# EAGLE schematic whiskashisei-ver4.1 (EAGLE 9.0.1)
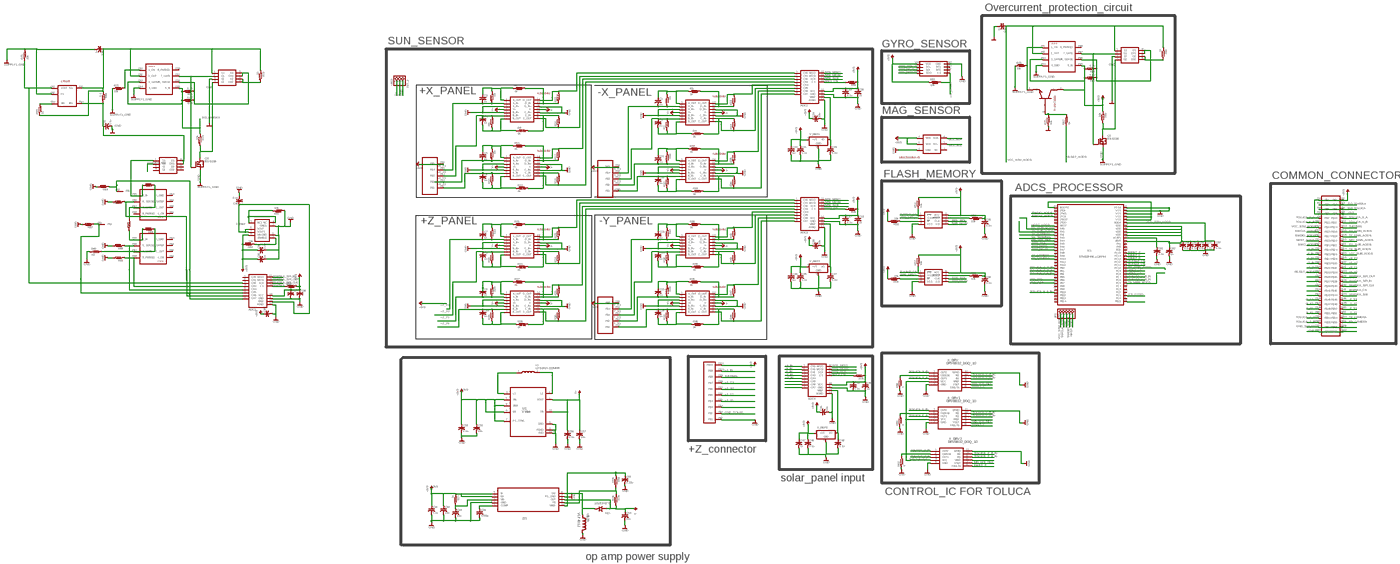
[diagram p0: schematic, sheet 1, overview]
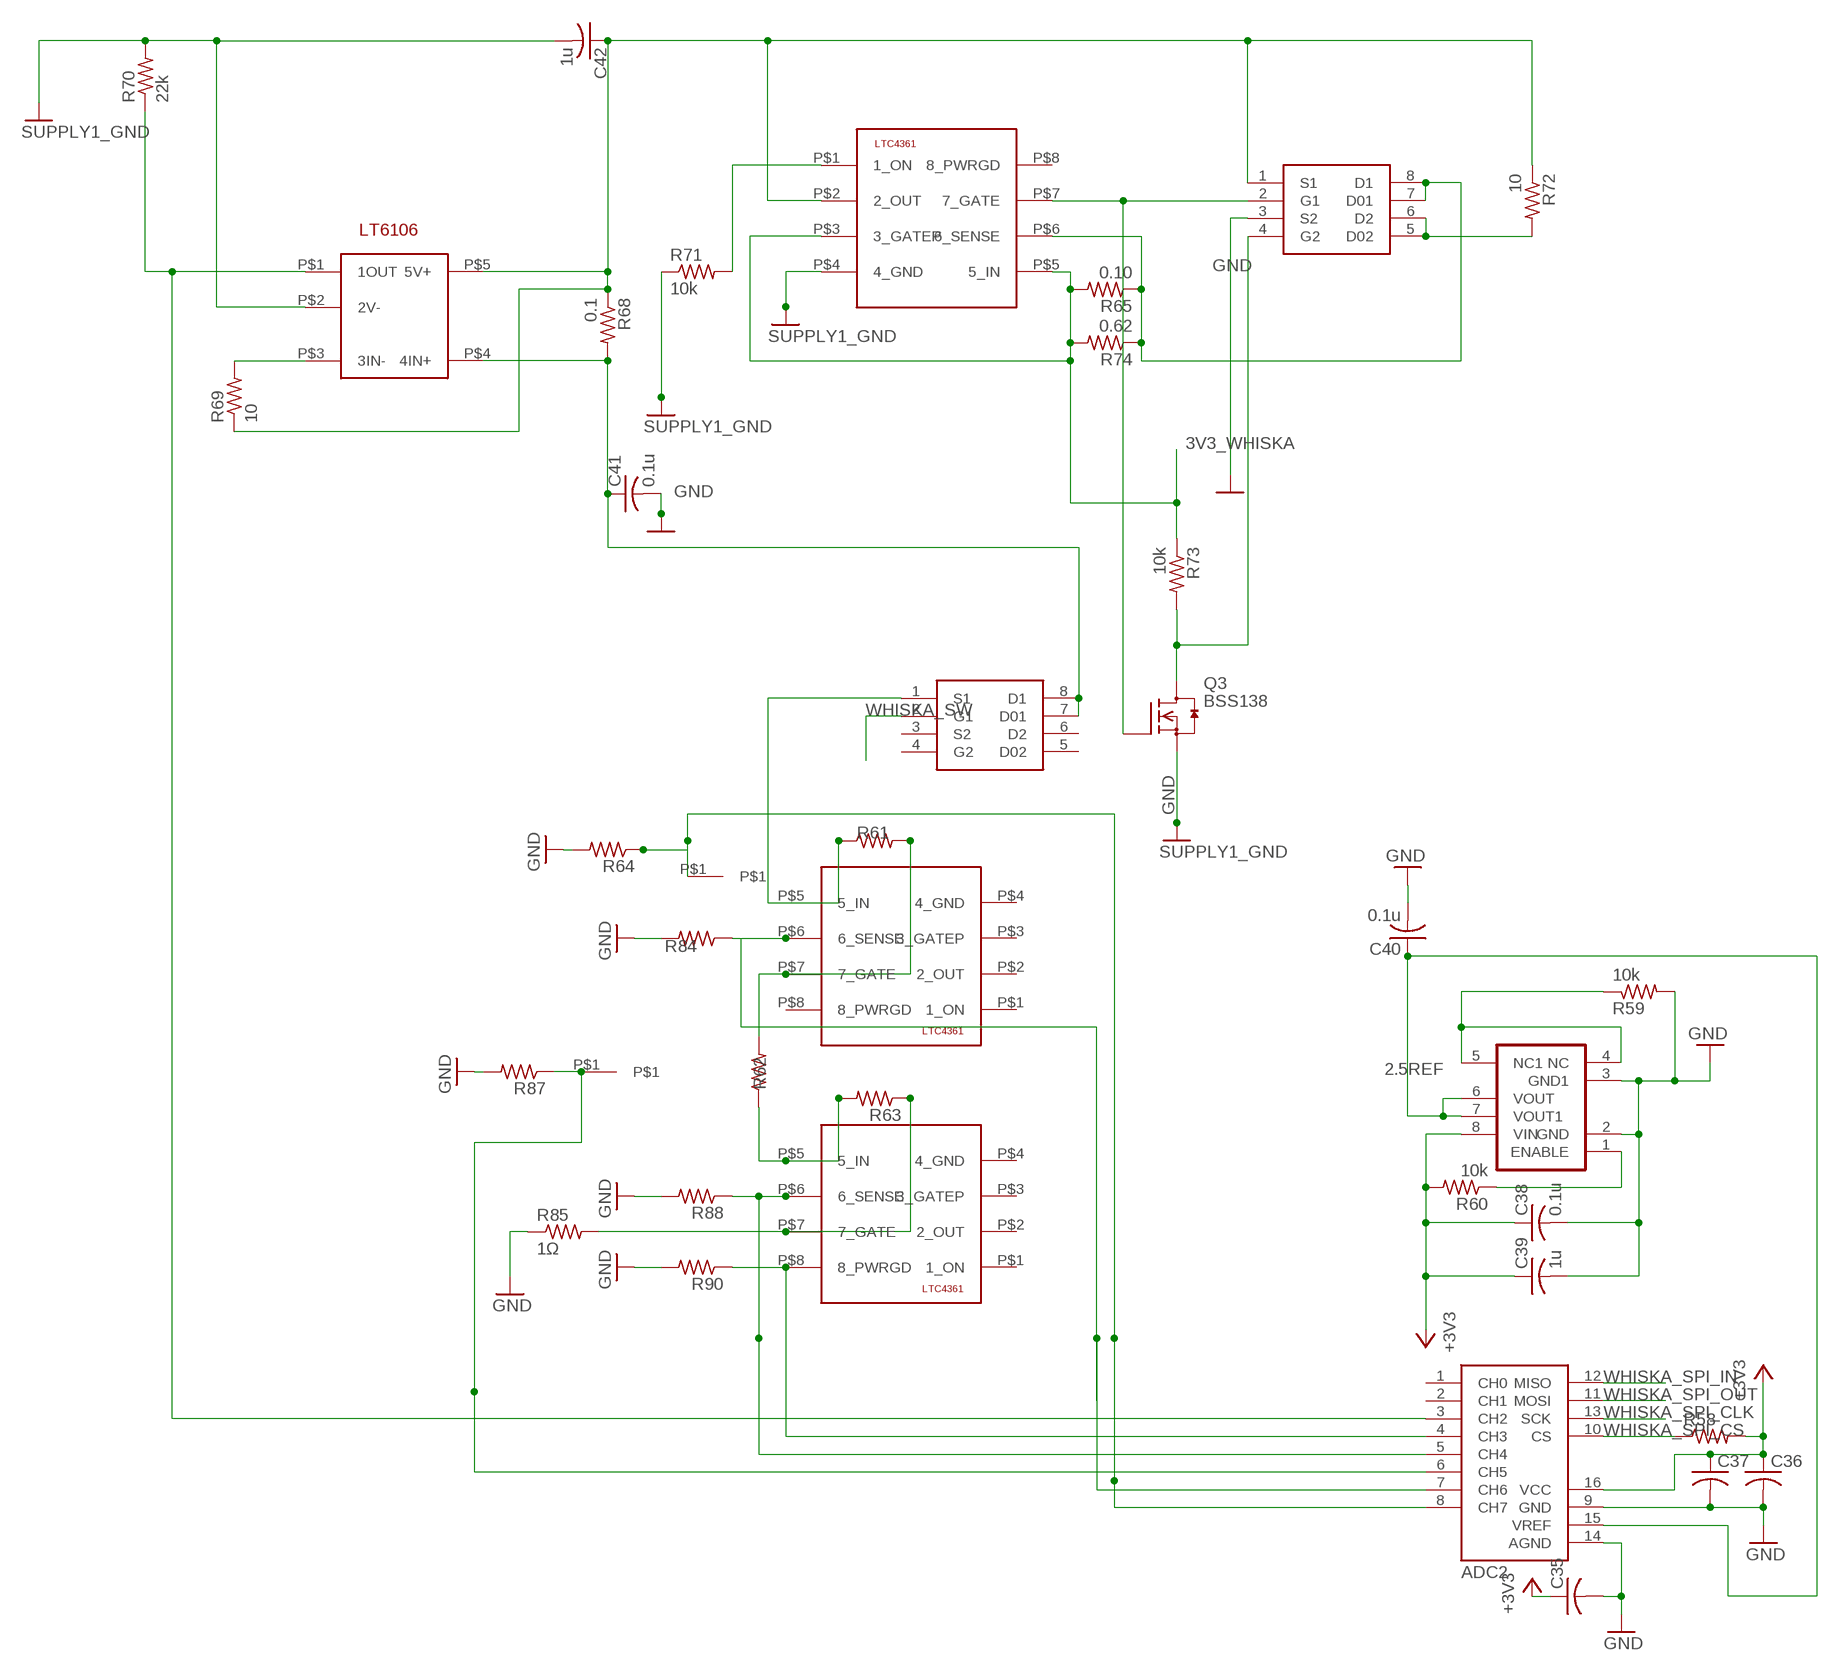
[diagram p1: schematic, sheet 1, part 1 of 4]
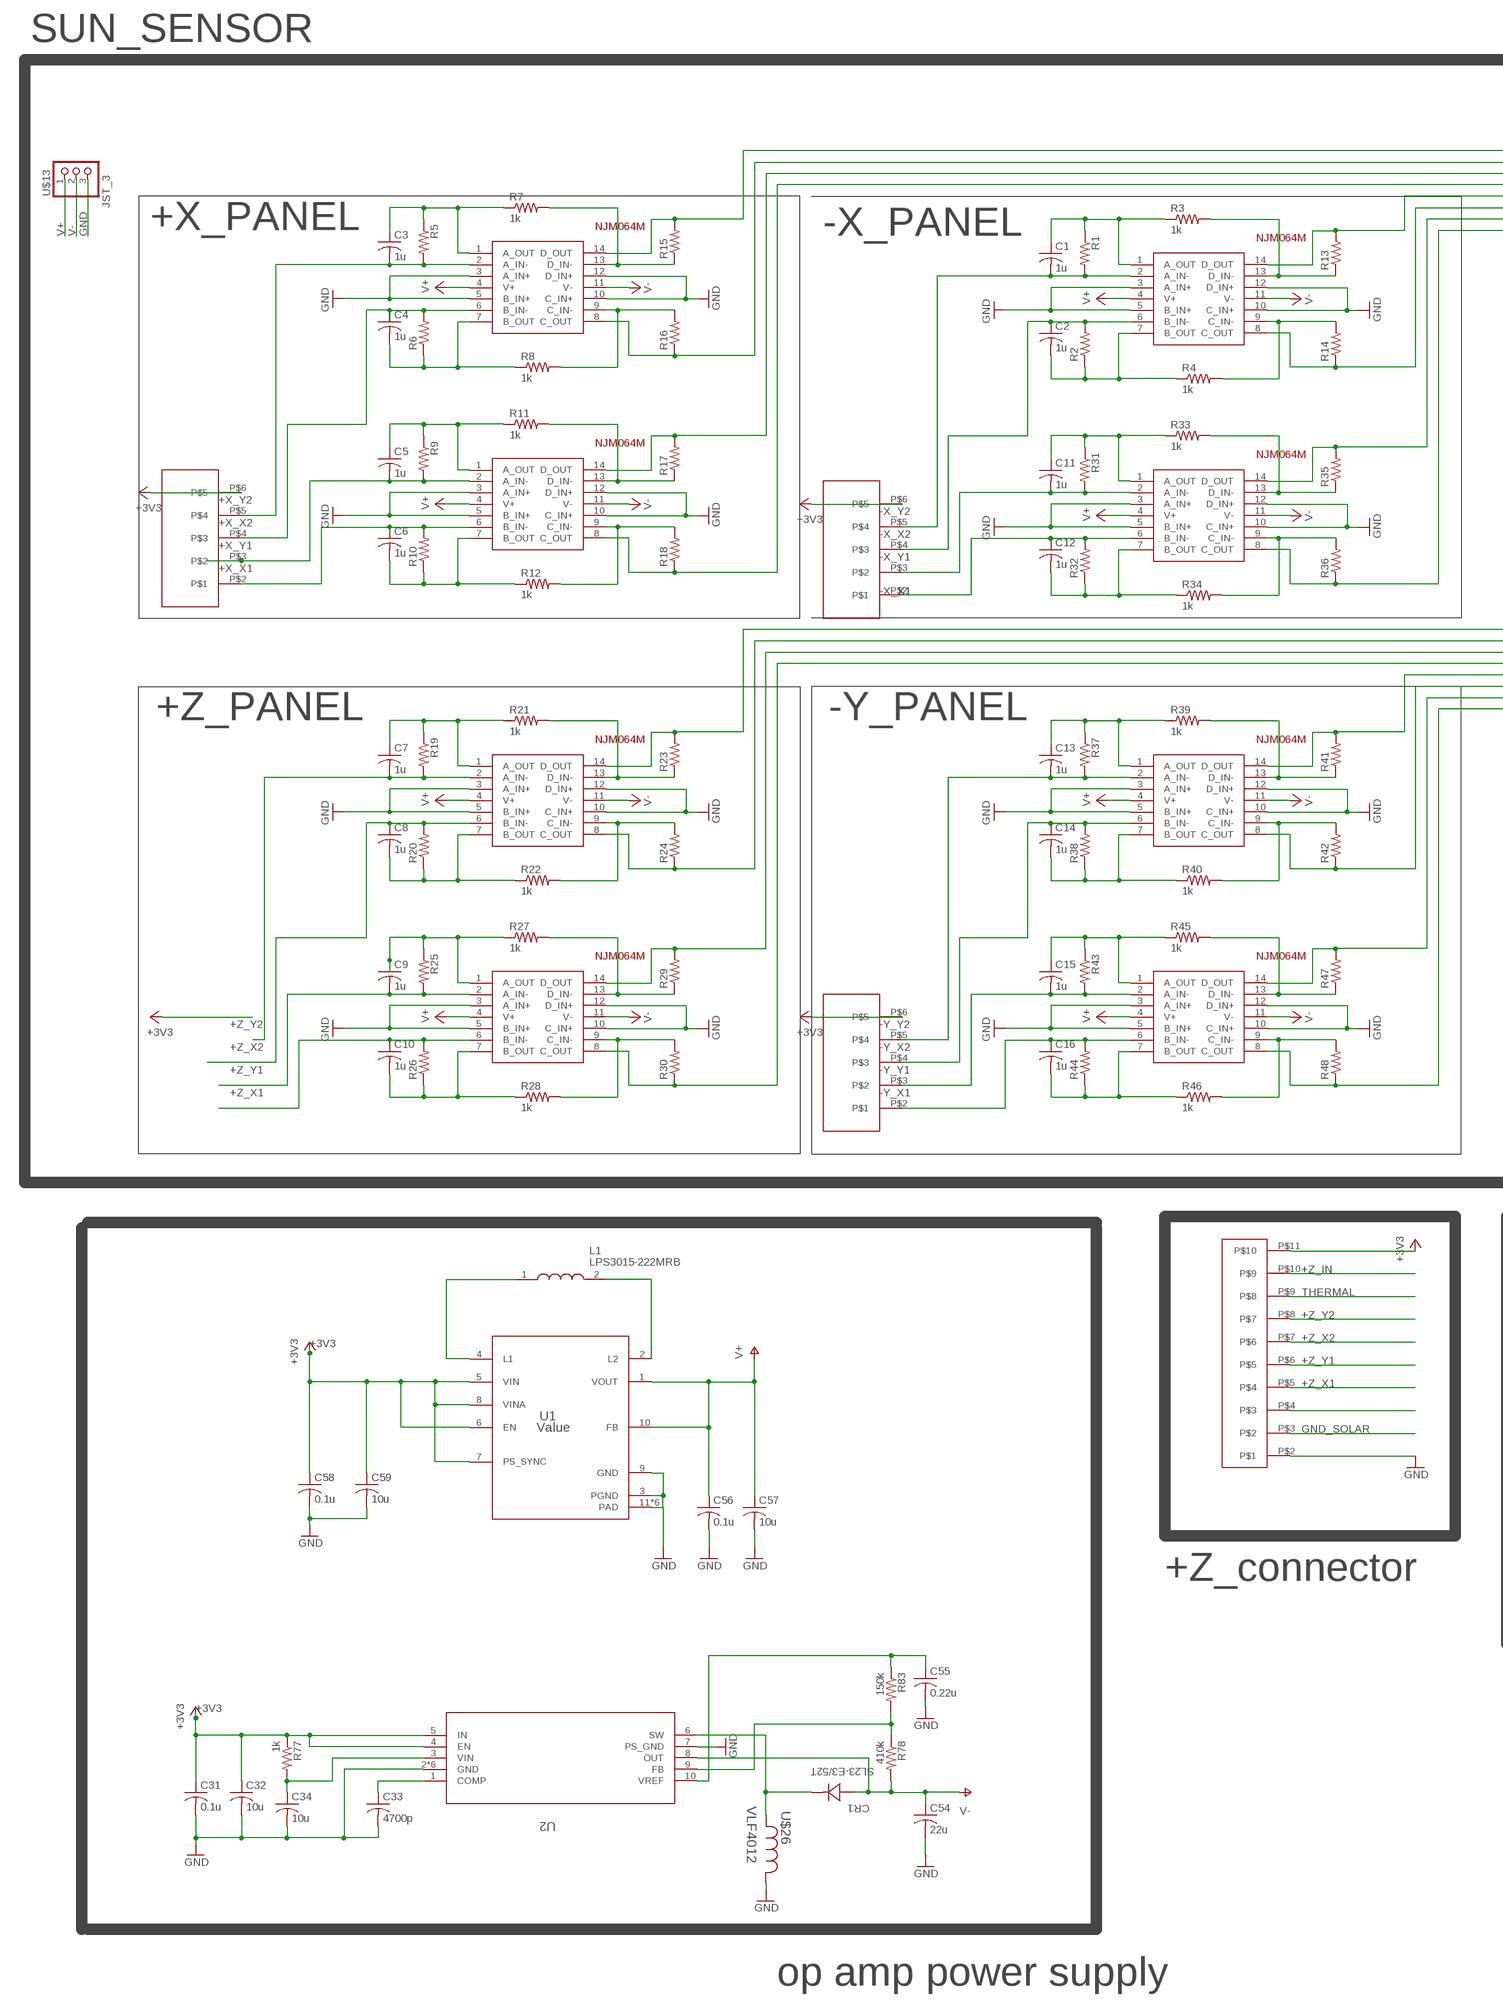
[diagram p2: schematic, sheet 1, part 2 of 4]
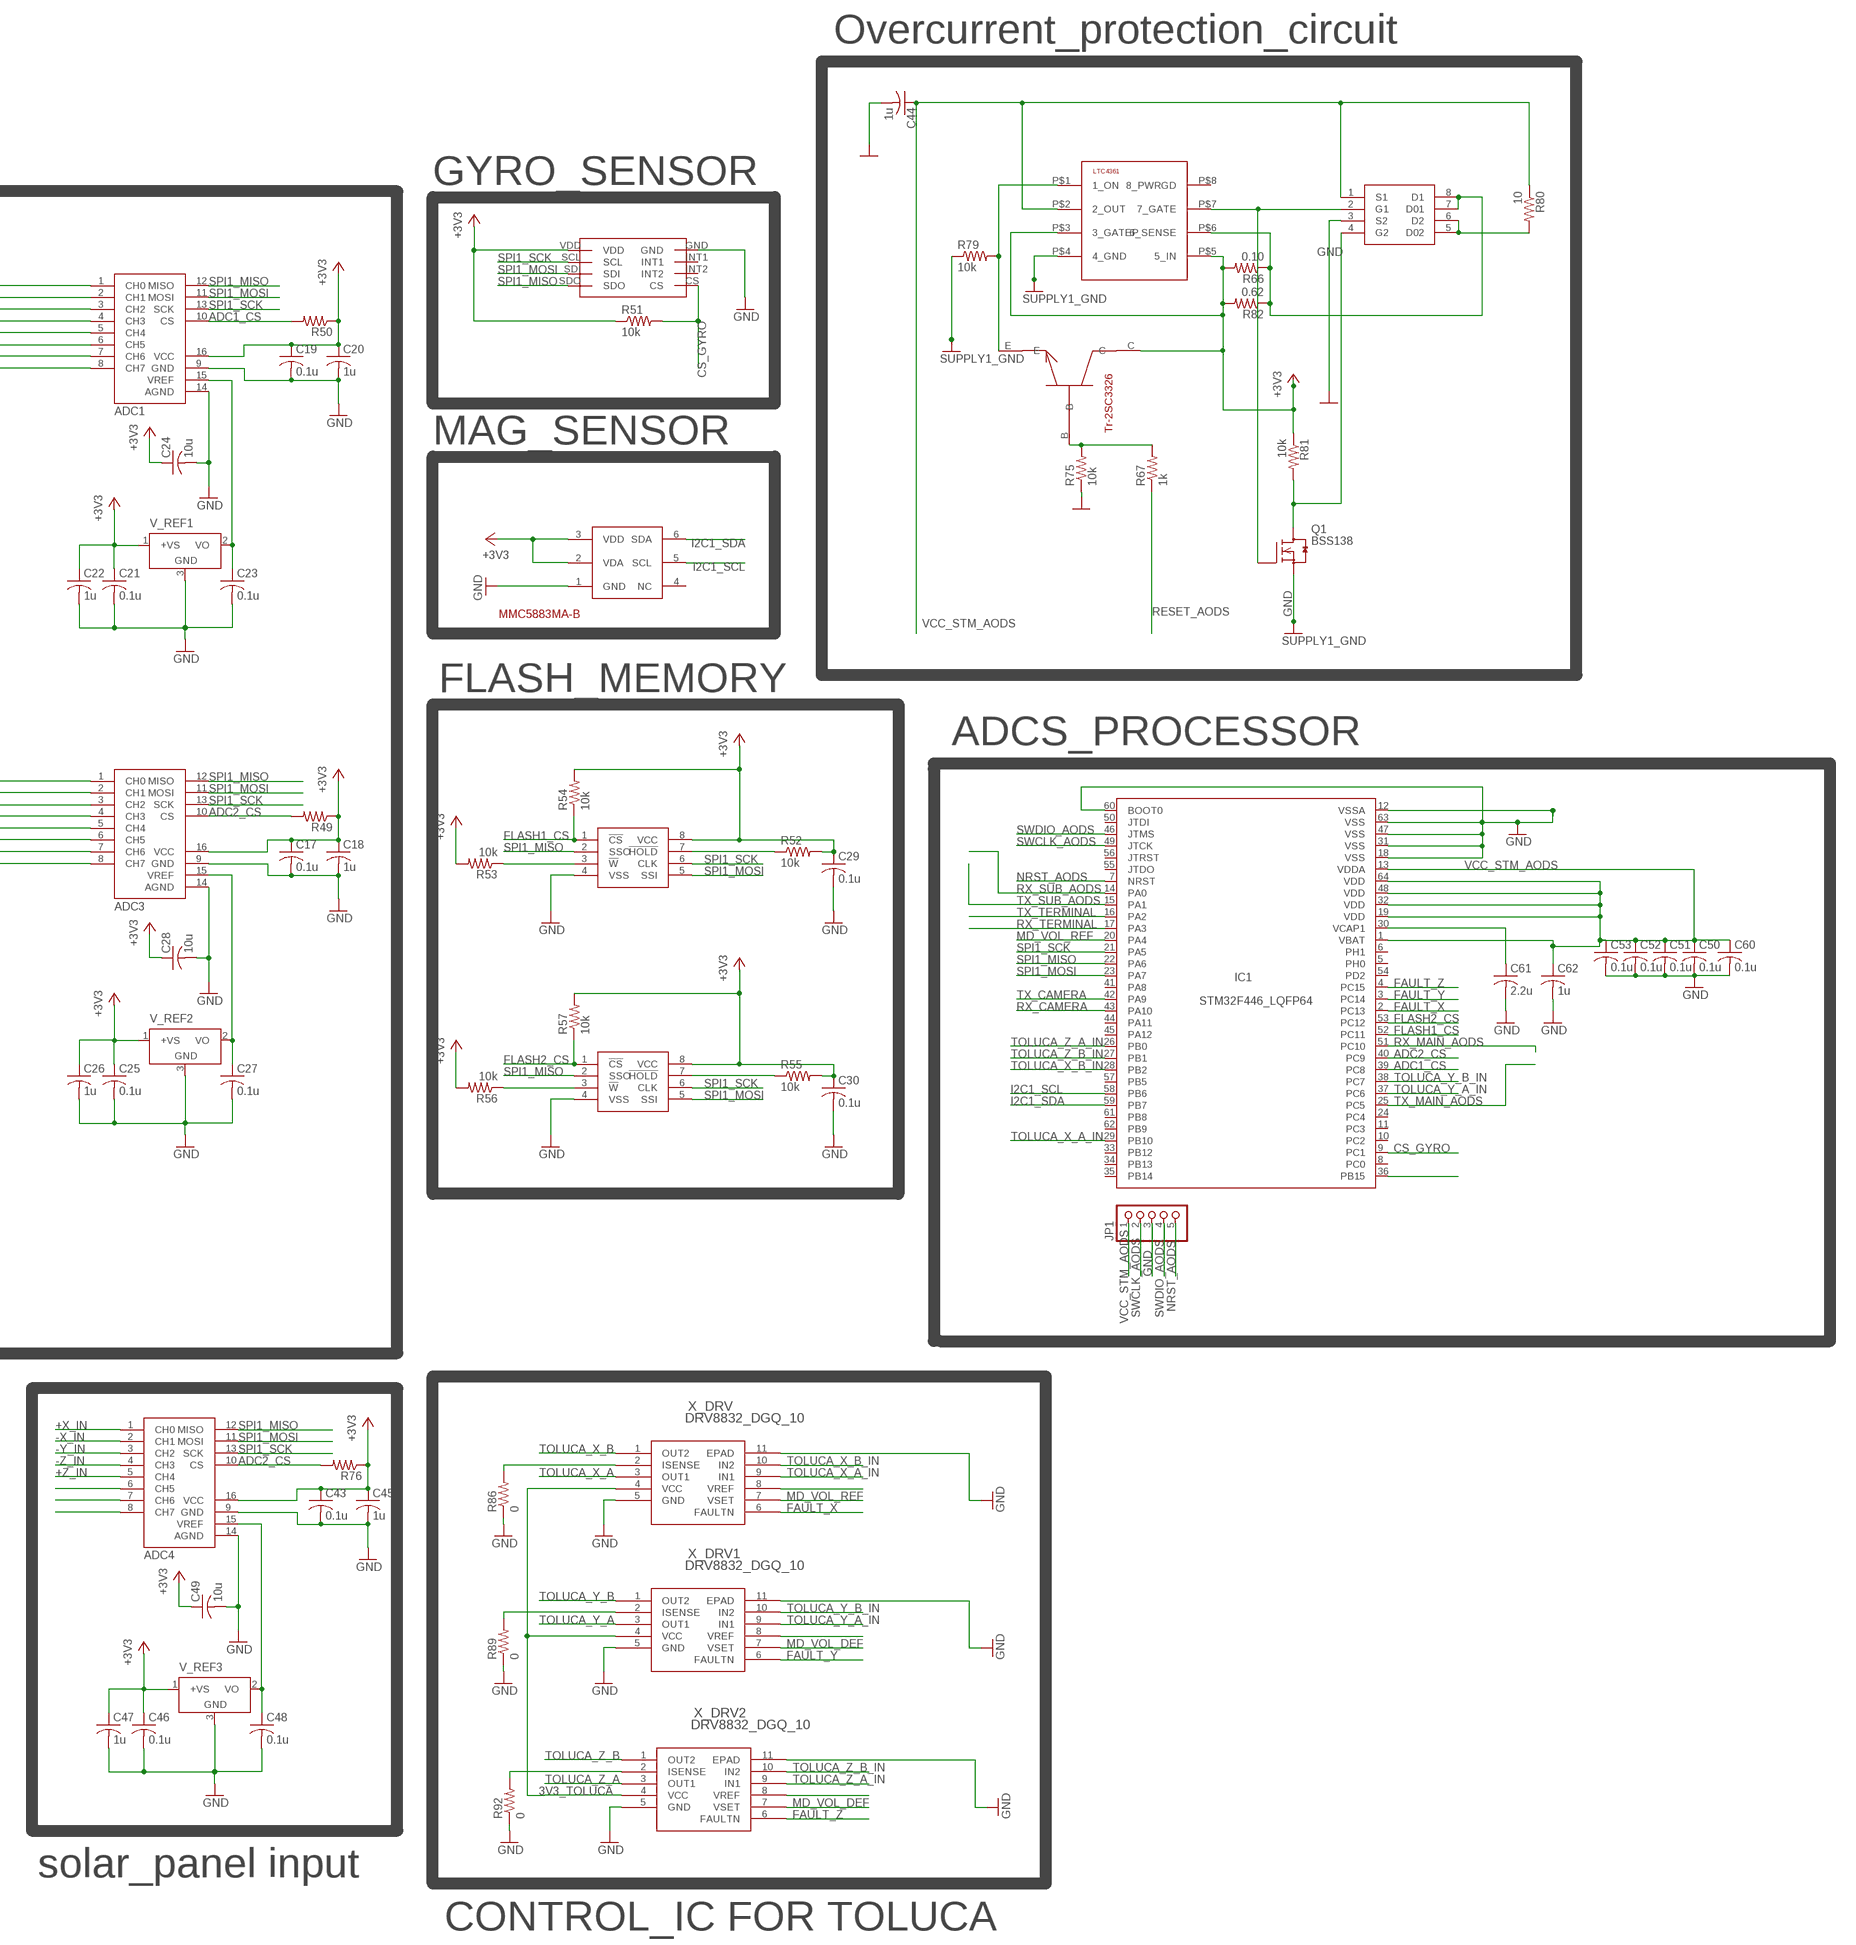
[diagram p3: schematic, sheet 1, part 3 of 4]
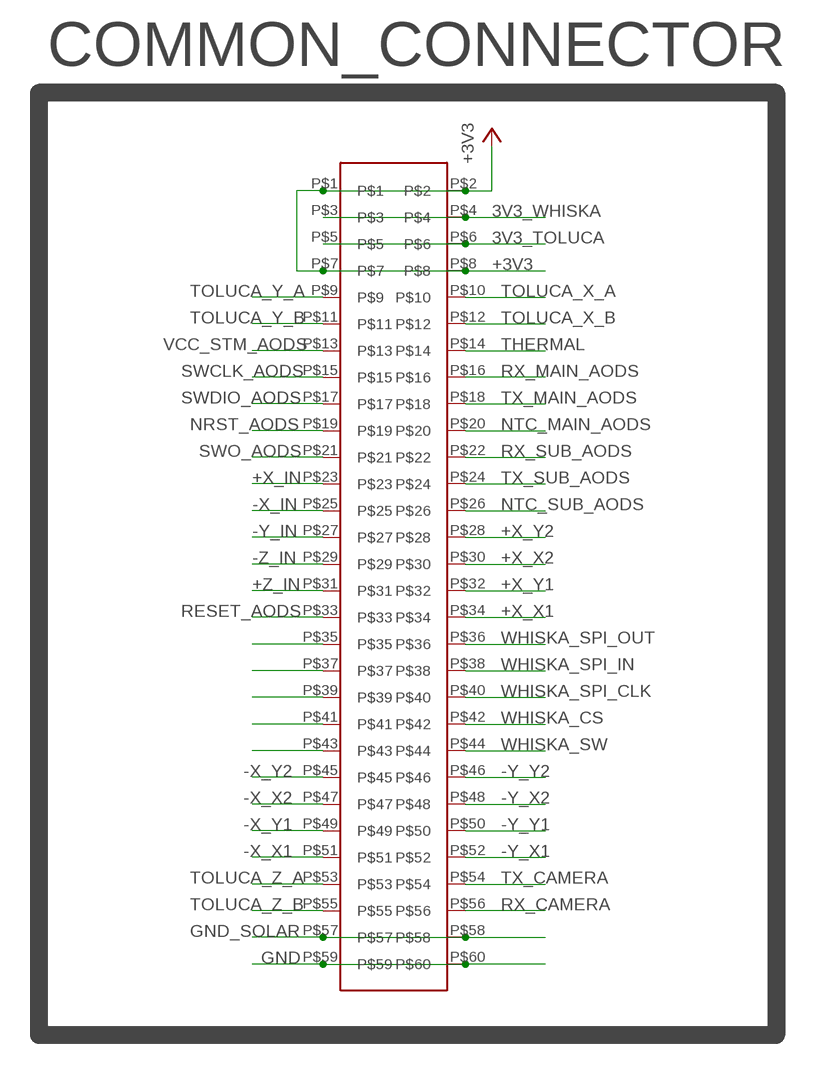
[diagram p4: schematic, sheet 1, part 4 of 4]

## Parts
ADC1  ADC_MCP3208  [SO16]
ADC2  ADC_MCP3208  [SO16]
ADC3  ADC_MCP3208  [SO16]
ADC4  ADC_MCP3208  [SO16]
C1  1u  C-USC2012  [C2012]
C2  1u  C-USC2012  [C2012]
C3  1u  C-USC2012  [C2012]
C4  1u  C-USC2012  [C2012]
C5  1u  C-USC2012  [C2012]
C6  1u  C-USC2012  [C2012]
C7  1u  C-USC2012  [C2012]
C8  1u  C-USC2012  [C2012]
C9  1u  C-USC2012  [C2012]
C10  1u  C-USC2012  [C2012]
C11  1u  C-USC2012  [C2012]
C12  1u  C-USC2012  [C2012]
C13  1u  C-USC2012  [C2012]
C14  1u  C-USC2012  [C2012]
C15  1u  C-USC2012  [C2012]
C16  1u  C-USC2012  [C2012]
C17  0.1u  C-USC2012  [C2012]
C18  1u  C-USC2012  [C2012]
C19  0.1u  C-USC2012  [C2012]
C20  1u  C-USC2012  [C2012]
C21  0.1u  C-USC2012  [C2012]
C22  1u  C-USC2012  [C2012]
C23  0.1u  C-USC2012  [C2012]
C24  10u  C-USC2012  [C2012]
C25  0.1u  C-USC2012  [C2012]
C26  1u  C-USC2012  [C2012]
C27  0.1u  C-USC2012  [C2012]
C28  10u  C-USC2012  [C2012]
C29  0.1u  C-USC2012  [C2012]
C30  0.1u  C-USC2012  [C2012]
C31  0.1u  C-USC2012  [C2012]
C32  10u  C-USC2012  [C2012]
C33  4700p  C-USC2012  [C2012]
C34  10u  C-USC2012  [C2012]
C35  C-USC2012  [C2012]
C36  C-USC2012  [C2012]
C37  C-USC2012  [C2012]
C38  0.1u  C-USC2012  [C2012]
C39  1u  C-USC2012  [C2012]
C40  0.1u  C-USC2012  [C2012]
C41  0.1u  C-USC2012  [C2012]
C42  1u  C-USC2012  [C2012]
C43  0.1u  C-USC2012  [C2012]
C44  1u  C-USC2012  [C2012]
C45  1u  C-USC2012  [C2012]
C46  0.1u  C-USC2012  [C2012]
C47  1u  C-USC2012  [C2012]
C48  0.1u  C-USC2012  [C2012]
C49  10u  C-USC2012  [C2012]
C50  0.1u  C-USC2012  [C2012]
C51  0.1u  C-USC2012  [C2012]
C52  0.1u  C-USC2012  [C2012]
C53  0.1u  C-USC2012  [C2012]
C54  22u  C-USC2012  [C2012]
C55  0.22u  C-USC2012  [C2012]
C56  0.1u  C-USC2012  [C2012]
C57  10u  C-USC2012  [C2012]
C58  0.1u  C-USC2012  [C2012]
C59  10u  C-USC2012  [C2012]
C60  0.1u  C-USC2012  [C2012]
C61  2.2u  C-USC2012  [C2012]
C62  1u  C-USC2012  [C2012]
CR1  SL23-E3/52T  [DIODE_DO214AA]
FLASH_CAM  MP25P80  [SO-08M]
FLASH_SENSOR  MP25P80  [SO-08M]
IC1  STM32F446_LQFP64  [LQFP64_PACKAGE]
JP1  PINHD-1X5  [1X05]
L1  LPS3015-222MRB  [LPS3015]
Q1  BSS138  [SOT23]
Q3  BSS138  [SOT23]
R1  R-US_R2012  [R2012]
R2  R-US_R2012  [R2012]
R3  1k  R-US_R2012  [R2012]
R4  1k  R-US_R2012  [R2012]
R5  R-US_R2012  [R2012]
R6  R-US_R2012  [R2012]
R7  1k  R-US_R2012  [R2012]
R8  1k  R-US_R2012  [R2012]
R9  R-US_R2012  [R2012]
R10  R-US_R2012  [R2012]
R11  1k  R-US_R2012  [R2012]
R12  1k  R-US_R2012  [R2012]
R13  R-US_R2012  [R2012]
R14  R-US_R2012  [R2012]
R15  R-US_R2012  [R2012]
R16  R-US_R2012  [R2012]
R17  R-US_R2012  [R2012]
R18  R-US_R2012  [R2012]
R19  R-US_R2012  [R2012]
R20  R-US_R2012  [R2012]
R21  1k  R-US_R2012  [R2012]
R22  1k  R-US_R2012  [R2012]
R23  R-US_R2012  [R2012]
R24  R-US_R2012  [R2012]
R25  R-US_R2012  [R2012]
R26  R-US_R2012  [R2012]
R27  1k  R-US_R2012  [R2012]
R28  1k  R-US_R2012  [R2012]
R29  R-US_R2012  [R2012]
R30  R-US_R2012  [R2012]
R31  R-US_R2012  [R2012]
R32  R-US_R2012  [R2012]
R33  1k  R-US_R2012  [R2012]
R34  1k  R-US_R2012  [R2012]
R35  R-US_R2012  [R2012]
R36  R-US_R2012  [R2012]
R37  R-US_R2012  [R2012]
R38  R-US_R2012  [R2012]
R39  1k  R-US_R2012  [R2012]
R40  1k  R-US_R2012  [R2012]
R41  R-US_R2012  [R2012]
R42  R-US_R2012  [R2012]
R43  R-US_R2012  [R2012]
R44  R-US_R2012  [R2012]
R45  1k  R-US_R2012  [R2012]
R46  1k  R-US_R2012  [R2012]
R47  R-US_R2012  [R2012]
R48  R-US_R2012  [R2012]
R49  R-US_R2012  [R2012]
R50  R-US_R2012  [R2012]
R51  10k  R-US_R2012  [R2012]
R52  10k  R-US_R2012  [R2012]
R53  10k  R-US_R2012  [R2012]
R54  10k  R-US_R2012  [R2012]
R55  10k  R-US_R2012  [R2012]
R56  10k  R-US_R2012  [R2012]
R57  10k  R-US_R2012  [R2012]
R58  R-US_R2012  [R2012]
R59  10k  R-US_R2012  [R2012]
R60  10k  R-US_R2012  [R2012]
R61  R-US_R2012  [R2012]
R62  R-US_R2012  [R2012]
R63  R-US_R2012  [R2012]
R64  R-US_R2012  [R2012]
R65  0.10  R-US_R2012  [R2012]
R66  0.10  R-US_R2012  [R2012]
R67  1k  R-US_R2012  [R2012]
R68  0.1  R-US_R2012  [R2012]
R69  10  R-US_R2012  [R2012]
R70  22k  R-US_R2012  [R2012]
R71  10k  R-US_R2012  [R2012]
R72  10  R-US_R2012  [R2012]
R73  10k  R-US_R2012  [R2012]
R74  0.62  R-US_R2012  [R2012]
R75  10k  R-US_R2012  [R2012]
R76  R-US_R2012  [R2012]
R77  1k  R-US_R2012  [R2012]
R78  410k  R-US_R2012  [R2012]
R79  10k  R-US_R2012  [R2012]
R80  10  R-US_R2012  [R2012]
R81  10k  R-US_R2012  [R2012]
R82  0.62  R-US_R2012  [R2012]
R83  150k  R-US_R2012  [R2012]
R84  R-US_R2012  [R2012]
R85  1Ω  R-US_R2012  [R2012]
R86  0  R-US_R2012  [R2012]
R87  R-US_R2012  [R2012]
R88  R-US_R2012  [R2012]
R89  0  R-US_R2012  [R2012]
R90  R-US_R2012  [R2012]
R92  0  R-US_R2012  [R2012]
U1  Value  TPS63000DRCR  [DRC0010A]
U2  TPS63700DRCRG4  [DRC10_2P4X1P65]
U$1  1.27_60  [1.27_60]
U$3  MMC5883MA-B  [MMC5883MA-B]
U$4  L3GD20_SET  [L3GD20_SET]
U$5  NJM064M  [NJM064M]
U$6  NJM064M  [NJM064M]
U$7  NJM064M  [NJM064M]
U$8  NJM064M  [NJM064M]
U$9  NJM064M  [NJM064M]
U$10  NJM064M  [NJM064M]
U$11  NJM064M  [NJM064M]
U$12  NJM064M  [NJM064M]
U$13  JST_3  [JST_3]
U$14  ADR3525  [ADR3525]
U$15  LTC4361  [LTC4361_2]
U$16  IRF7910  [SO-08]
U$17  LTC4361  [LTC4361_2]
U$18  LT6106  [LT6106]
U$19  IRF7910  [SO-08]
U$20  TR-NPN-2SC3326  [TR-NPN-2SC3326]
U$21  JST_1MM_10  [JST_1MM_10]
U$22  IRF7910  [SO-08]
U$23  LTC4361  [LTC4361_2]
U$26  VLF4012  [IND_4012]
U$27  LTC4361  [LTC4361_2]
U$31  JST_1MM_5  [JST_1MM_5]
U$32  JST_1MM_5  [JST_1MM_5]
U$34  JST_1MM_5  [JST_1MM_5]
V_REF1  LM50  [SOT23]
V_REF2  LM50  [SOT23]
V_REF3  LM50  [SOT23]
WHISKAPAD1  WHISKAPAD  [LTC4361_2]
WHISKAPAD2  WHISKAPAD  [LTC4361_2]
X_DRV  DRV8832_DGQ_10  [DGQ10_2P18X1P72]
X_DRV1  DRV8832_DGQ_10  [DGQ10_2P18X1P72]
X_DRV2  DRV8832_DGQ_10  [DGQ10_2P18X1P72]

## Nets
2.5REF: ADC2.15(VREF) C40.1 U$14.6(VOUT) U$14.7(VOUT1)
3V3_TOLUCA: U$1.P$5 U$1.P$6 X_DRV1.4(VCC) X_DRV2.4(VCC) X_DRV.4(VCC)
3V3_WHISKA: R65.2 R73.1 R74.2 U$1.P$3 U$1.P$4 U$15.P$3(3_GATEP) U$15.P$5(5_IN)
+3V3: ADC1.16(VCC) ADC2.16(VCC) ADC3.16(VCC) ADC4.16(VCC) C17.1 C18.1 C19.1 C20.1 C21.1 C22.1 C24.1 C25.1 C26.1 C28.1 C29.1 C30.1 C31.1 C32.1 C35.1 C36.1 C37.1 C38.1 C39.1 C43.1 C45.1 C46.1 C47.1 C49.1 C58.1 C59.1 FLASH_CAM.8(VCC) FLASH_SENSOR.8(VCC) R49.1 R50.1 R51.1 R52.2 R53.2 R54.2 R55.2 R56.2 R57.2 R58.2 R60.2 R66.2 R76.1 R77.1 R81.1 R82.2 U1.5(VIN) U1.6(EN) U1.7(PS_SYNC) U1.8(VINA) U2.4(EN) U2.5(IN) U$1.P$1 U$1.P$2 U$1.P$7 U$1.P$8 U$3.2(VDA) U$3.3(VDD) U$4.VDD U$14.8(VIN) U$17.P$3(3_GATEP) U$17.P$5(5_IN) U$20.C U$21.P$11 U$31.P$6 U$32.P$6 U$34.P$6 V_REF1.1(+VS) V_REF2.1(+VS) V_REF3.1(+VS)
+X_IN: ADC4.1(CH0) U$1.P$23
+X_X1: C6.1 R10.2 U$1.P$34 U$7.6(B_IN-) U$31.P$2
+X_X2: C4.1 R6.2 U$1.P$30 U$6.6(B_IN-) U$31.P$4
+X_Y1: C5.2 R9.2 U$1.P$32 U$7.2(A_IN-) U$31.P$3
+X_Y2: C3.2 R5.2 U$1.P$28 U$6.2(A_IN-) U$31.P$5
+Z_IN: ADC4.5(CH4) U$1.P$31 U$21.P$10
+Z_X1: C10.1 R26.2 U$9.6(B_IN-) U$21.P$5
+Z_X2: C8.1 R20.2 U$8.6(B_IN-) U$21.P$7
+Z_Y1: C9.2 R25.2 U$9.2(A_IN-) U$21.P$6
+Z_Y2: C7.2 R19.2 U$8.2(A_IN-) U$21.P$8
-X_IN: ADC4.2(CH1) U$1.P$25
-X_X1: C12.1 R32.2 U$1.P$51 U$10.6(B_IN-) U$32.P$2
-X_X2: C2.1 R2.2 U$1.P$47 U$5.6(B_IN-) U$32.P$4
-X_Y1: C11.2 R31.2 U$1.P$49 U$10.2(A_IN-) U$32.P$3
-X_Y2: C1.2 R1.2 U$1.P$45 U$5.2(A_IN-) U$32.P$5
-Y_IN: ADC4.3(CH2) U$1.P$27
-Y_X1: C16.1 R44.2 U$1.P$52 U$12.6(B_IN-) U$34.P$2
-Y_X2: C14.1 R38.2 U$1.P$48 U$11.6(B_IN-) U$34.P$4
-Y_Y1: C15.2 R43.2 U$1.P$50 U$12.2(A_IN-) U$34.P$3
-Y_Y2: C13.2 R37.2 U$1.P$46 U$11.2(A_IN-) U$34.P$5
-Z_IN: ADC4.4(CH3) U$1.P$29
ADC1_CS: ADC1.10(CS) IC1.39(PC8) R50.2
ADC2_CS: ADC3.10(CS) ADC4.10(CS) IC1.40(PC9) R49.2 R76.2
CRT-18F: ADC2.3(CH2) R70.1 U$18.P$1(1OUT)
CS_GYRO: IC1.9(PC1) R51.2 U$4.CS
FAULT_X: IC1.2(PC13) X_DRV.6(FAULTN)
FAULT_Y: IC1.3(PC14) X_DRV1.6(FAULTN)
FAULT_Z: IC1.4(PC15) X_DRV2.6(FAULTN)
FLASH1_CS: FLASH_SENSOR.1(!CS) IC1.52(PC11) R54.1
FLASH2_CS: FLASH_CAM.1(!CS) IC1.53(PC12) R57.1
GND: ADC1.9(GND) ADC1.14(AGND) ADC2.9(GND) ADC2.14(AGND) ADC3.9(GND) ADC3.14(AGND) ADC4.9(GND) ADC4.14(AGND) C17.2 C18.2 C19.2 C20.2 C21.2 C22.2 C23.2 C24.2 C25.2 C26.2 C27.2 C28.2 C29.2 C30.2 C31.2 C32.2 C33.2 C34.2 C35.2 C36.2 C37.2 C38.2 C39.2 C40.2 C41.2 C42.2 C43.2 C44.2 C45.2 C46.2 C47.2 C48.2 C49.2 C50.2 C51.2 C52.2 C53.2 C54.2 C55.2 C56.2 C57.2 C58.2 C59.2 C60.2 C61.2 C62.2 FLASH_CAM.4(VSS) FLASH_SENSOR.4(VSS) IC1.12(VSSA) IC1.18(VSS) IC1.31(VSS) IC1.47(VSS) IC1.60(BOOT0) IC1.63(VSS) JP1.3 Q1.2(S) Q3.2(S) R59.2 R64.2 R70.2 R71.1 R75.1 R79.1 R84.2 R85.1 R86.1 R87.2 R88.2 R89.1 R90.2 R92.1 U1.3(PGND) U1.9(GND) U1.11(PAD) U1.P$1(PAD) U1.P$2(PAD) U1.P$3(PAD) U1.P$4(PAD) U1.V(PAD) U2.2(GND) U2.7(PS_GND) U2.11(GND) U2.12(GND) U2.13(GND) U2.14(GND) U2.15(GND) U$1.P$59 U$1.P$60 U$3.1(GND) U$4.GND U$5.3(A_IN+) U$5.5(B_IN+) U$5.10(C_IN+) U$5.12(D_IN+) U$6.3(A_IN+) U$6.5(B_IN+) U$6.10(C_IN+) U$6.12(D_IN+) U$7.3(A_IN+) U$7.5(B_IN+) U$7.10(C_IN+) U$7.12(D_IN+) U$8.3(A_IN+) U$8.5(B_IN+) U$8.10(C_IN+) U$8.12(D_IN+) U$9.3(A_IN+) U$9.5(B_IN+) U$9.10(C_IN+) U$9.12(D_IN+) U$10.3(A_IN+) U$10.5(B_IN+) U$10.10(C_IN+) U$10.12(D_IN+) U$11.3(A_IN+) U$11.5(B_IN+) U$11.10(C_IN+) U$11.12(D_IN+) U$12.3(A_IN+) U$12.5(B_IN+) U$12.10(C_IN+) U$12.12(D_IN+) U$13.3 U$14.2(GND) U$14.3(GND1) U$15.P$4(4_GND) U$16.3(S2) U$17.P$4(4_GND) U$18.P$2(2V-) U$19.3(S2) U$21.P$2 U$26.1 V_REF1.3(GND) V_REF2.3(GND) V_REF3.3(GND) X_DRV1.5(GND) X_DRV1.11(EPAD) X_DRV2.5(GND) X_DRV2.11(EPAD) X_DRV.5(GND) X_DRV.11(EPAD) ; supply symbol labelled SUPPLY1_GND
GND_SOLAR: U$1.P$57 U$1.P$58 U$21.P$3
I2C1_SCL: IC1.58(PB6) U$3.5(SCL)
I2C1_SDA: IC1.59(PB7) U$3.6(SDA)
MD_VOL_DEF: X_DRV1.7(VSET) X_DRV2.7(VSET)
MD_VOL_REF: IC1.20(PA4) X_DRV.7(VSET)
N$1: C4.2 R6.1 R8.1 U$6.7(B_OUT)
N$2: ADC1.1(CH0) R15.2 U$6.14(D_OUT)
N$3: ADC1.2(CH1) R16.1 U$6.8(C_OUT)
N$4: ADC1.6(CH5) R14.1 U$5.8(C_OUT)
N$5: R8.2 R16.2 U$6.9(C_IN-)
N$6: ADC1.7(CH6) R35.2 U$10.14(D_OUT)
N$7: ADC1.8(CH7) R36.1 U$10.8(C_OUT)
N$8: ADC1.5(CH4) R13.2 U$5.14(D_OUT)
N$9: ADC3.1(CH0) R23.2 U$8.14(D_OUT)
N$10: C2.2 R2.1 R4.1 U$5.7(B_OUT)
N$11: R4.2 R14.2 U$5.9(C_IN-)
N$12: C8.2 R20.1 R22.1 U$8.7(B_OUT)
N$13: C1.1 R1.1 R3.1 U$5.1(A_OUT)
N$14: R3.2 R13.1 U$5.13(D_IN-)
N$15: C33.1 U2.1(COMP)
N$16: C3.1 R5.1 R7.1 U$6.1(A_OUT)
N$17: R7.2 R15.1 U$6.13(D_IN-)
N$20: U$21.P$4
N$21: C6.2 R10.1 R12.1 U$7.7(B_OUT)
N$22: R12.2 R18.2 U$7.9(C_IN-)
N$23: C5.1 R9.1 R11.1 U$7.1(A_OUT)
N$24: R11.2 R17.1 U$7.13(D_IN-)
N$25: R61.1 U$22.1(S1) U$23.P$5(5_IN)
N$27: ADC1.15(VREF) C23.1 V_REF1.2(VO)
N$28: ADC1.4(CH3) R18.1 U$7.8(C_OUT)
N$29: C12.2 R32.1 R34.1 U$10.7(B_OUT)
N$30: ADC1.3(CH2) R17.2 U$7.14(D_OUT)
N$31: R22.2 R24.2 U$8.9(C_IN-)
N$32: C7.1 R19.1 R21.1 U$8.1(A_OUT)
N$33: R21.2 R23.1 U$8.13(D_IN-)
N$36: C10.2 R26.1 R28.1 U$9.7(B_OUT)
N$37: R28.2 R30.2 U$9.9(C_IN-)
N$38: C9.1 R25.1 R27.1 U$9.1(A_OUT)
N$39: R27.2 R29.1 U$9.13(D_IN-)
N$40: C55.1 R83.1 U2.10(VREF)
N$41: C34.1 R77.2 U2.3(VIN)
N$42: ADC3.3(CH2) R29.2 U$9.14(D_OUT)
N$43: ADC3.4(CH3) R30.1 U$9.8(C_OUT)
N$44: R61.2 R62.2 U$23.P$7(7_GATE)
N$45: ADC3.2(CH1) R24.1 U$8.8(C_OUT)
N$46: R34.2 R36.2 U$10.9(C_IN-)
N$47: C11.1 R31.1 R33.1 U$10.1(A_OUT)
N$48: R33.2 R35.1 U$10.13(D_IN-)
N$49: ADC4.6(CH5)
N$50: ADC4.7(CH6)
N$51: X_DRV.8(VREF)
N$52: ADC3.15(VREF) C27.1 V_REF2.2(VO)
N$53: ADC3.5(CH4) R41.2 U$11.14(D_OUT)
N$54: ADC3.6(CH5) R42.1 U$11.8(C_OUT)
N$55: C14.2 R38.1 R40.1 U$11.7(B_OUT)
N$56: R40.2 R42.2 U$11.9(C_IN-)
N$57: C13.1 R37.1 R39.1 U$11.1(A_OUT)
N$58: R39.2 R41.1 U$11.13(D_IN-)
N$59: ADC4.8(CH7)
N$60: ADC4.15(VREF) C48.1 V_REF3.2(VO)
N$61: C16.2 R44.1 R46.1 U$12.7(B_OUT)
N$62: R46.2 R48.2 U$12.9(C_IN-)
N$63: C15.1 R43.1 R45.1 U$12.1(A_OUT)
N$64: R45.2 R47.1 U$12.13(D_IN-)
N$65: R78.1 R83.2 U2.9(FB)
N$66: CR1.1 U2.6(SW) U$26.2
N$67: ADC3.7(CH6) R47.2 U$12.14(D_OUT)
N$68: ADC3.8(CH7) R48.1 U$12.8(C_OUT)
N$69: R65.1 R74.1 U$15.P$6(6_SENSE) U$16.7(D01) U$16.8(D1)
N$70: FLASH_SENSOR.3(!W) R53.1
N$71: FLASH_CAM.7(!HOLD) R55.1
N$72: Q3.1(G) U$15.P$7(7_GATE) U$16.2(G1)
N$73: FLASH_CAM.3(!W) R56.1
N$74: FLASH_SENSOR.7(!HOLD) R52.1
N$75: C42.1 R68.1 R69.1 R72.1 U$15.P$2(2_OUT) U$16.1(S1) U$18.P$5(5V+)
N$78: R89.2 X_DRV1.2(ISENSE)
N$79: R62.1 R63.2 U$27.P$5(5_IN)
N$80: L1.1 U1.4(L1)
N$81: L1.2 U1.2(L2)
N$82: X_DRV2.8(VREF)
N$86: R59.1 U$14.4(NC) U$14.5(NC1)
N$87: R60.1 U$14.1(ENABLE)
N$89: IC1.36(PB15)
N$91: R71.2 U$15.P$1(1_ON)
N$92: C41.1 R68.2 U$18.P$4(4IN+) U$22.7(D01) U$22.8(D1)
N$93: R69.2 U$18.P$3(3IN-)
N$94: R72.2 U$16.5(D02) U$16.6(D2)
N$95: Q3.3(D) R73.2 U$16.4(G2)
N$96: R66.1 R82.1 U$17.P$6(6_SENSE) U$19.7(D01) U$19.8(D1)
N$97: Q1.1(G) U$17.P$7(7_GATE) U$19.2(G1)
N$99: R79.2 U$17.P$1(1_ON) U$20.E
N$100: R67.2 R75.2 U$20.B
N$102: R80.2 U$19.5(D02) U$19.6(D2)
N$103: Q1.3(D) R81.2 U$19.4(G2)
N$106: U$1.P$35
N$107: U$1.P$37
N$108: U$1.P$39
N$109: U$1.P$41
N$110: U$1.P$43
N$113: R92.2 X_DRV2.2(ISENSE)
N$114: ADC2.6(CH5) R87.1 WHISKAPAD1.P$1
N$115: X_DRV1.8(VREF)
N$116: ADC2.4(CH3) R90.1 U$27.P$8(8_PWRGD)
N$117: ADC2.5(CH4) R88.1 U$27.P$6(6_SENSE)
N$118: R86.2 X_DRV.2(ISENSE)
N$119: R63.1 R85.2 U$27.P$7(7_GATE)
N$120: ADC2.8(CH7) R64.1 WHISKAPAD2.P$1
N$121: ADC2.7(CH6) R84.1 U$23.P$6(6_SENSE)
N$122: C61.1 IC1.30(VCAP1)
NRST_AODS: IC1.7(NRST) JP1.5 U$1.P$19
NTC_MAIN_AODS: U$1.P$20
NTC_SUB_AODS: U$1.P$26
RESET_AODS: R67.1 U$1.P$33
RX_CAMERA: IC1.43(PA10) U$1.P$56
RX_MAIN_AODS: IC1.51(PC10) U$1.P$16
RX_SUB_AODS: IC1.14(PA0) U$1.P$22
RX_TERMINAL: IC1.17(PA3)
SPI1_MISO: ADC1.12(MISO) ADC3.12(MISO) ADC4.12(MISO) FLASH_CAM.2(SSO) FLASH_SENSOR.2(SSO) IC1.22(PA6) U$4.SDO
SPI1_MOSI: ADC1.11(MOSI) ADC3.11(MOSI) ADC4.11(MOSI) FLASH_CAM.5(SSI) FLASH_SENSOR.5(SSI) IC1.23(PA7) U$4.SDI
SPI1_SCK: ADC1.13(SCK) ADC3.13(SCK) ADC4.13(SCK) FLASH_CAM.6(CLK) FLASH_SENSOR.6(CLK) IC1.21(PA5) U$4.SCL
SWCLK_AODS: IC1.49(JTCK) JP1.2 U$1.P$15
SWDIO_AODS: IC1.46(JTMS) JP1.4 U$1.P$17
SWO_AODS: U$1.P$21
THERMAL: U$1.P$14 U$21.P$9
TOLUCA_X_A: U$1.P$10 X_DRV.3(OUT1)
TOLUCA_X_A_IN: IC1.29(PB10) X_DRV.9(IN1)
TOLUCA_X_B: U$1.P$12 X_DRV.1(OUT2)
TOLUCA_X_B_IN: IC1.28(PB2) X_DRV.10(IN2)
TOLUCA_Y_A: U$1.P$9 X_DRV1.3(OUT1)
TOLUCA_Y_A_IN: IC1.37(PC6) X_DRV1.9(IN1)
TOLUCA_Y_B: U$1.P$11 X_DRV1.1(OUT2)
TOLUCA_Y_B_IN: IC1.38(PC7) X_DRV1.10(IN2)
TOLUCA_Z_A: U$1.P$53 X_DRV2.3(OUT1)
TOLUCA_Z_A_IN: IC1.26(PB0) X_DRV2.9(IN1)
TOLUCA_Z_B: U$1.P$55 X_DRV2.1(OUT2)
TOLUCA_Z_B_IN: IC1.27(PB1) X_DRV2.10(IN2)
TX_CAMERA: IC1.42(PA9) U$1.P$54
TX_MAIN_AODS: IC1.25(PC5) U$1.P$18
TX_SUB_AODS: IC1.15(PA1) U$1.P$24
TX_TERMINAL: IC1.16(PA2)
V+: C56.1 C57.1 U1.1(VOUT) U1.10(FB) U$5.4(V+) U$6.4(V+) U$7.4(V+) U$8.4(V+) U$9.4(V+) U$10.4(V+) U$11.4(V+) U$12.4(V+) U$13.1
V-: C54.1 CR1.2 R78.2 U2.8(OUT) U$5.11(V-) U$6.11(V-) U$7.11(V-) U$8.11(V-) U$9.11(V-) U$10.11(V-) U$11.11(V-) U$12.11(V-) U$13.2
VCC_STM_AODS: C44.1 C50.1 C51.1 C52.1 C53.1 C60.1 C62.1 IC1.1(VBAT) IC1.13(VDDA) IC1.19(VDD) IC1.32(VDD) IC1.48(VDD) IC1.64(VDD) JP1.1 R80.1 U$1.P$13 U$17.P$2(2_OUT) U$19.1(S1)
WHISKA_CS: U$1.P$42
WHISKA_SPI_CLK: ADC2.13(SCK) U$1.P$40
WHISKA_SPI_CS: ADC2.10(CS) R58.1
WHISKA_SPI_IN: ADC2.12(MISO) U$1.P$38
WHISKA_SPI_OUT: ADC2.11(MOSI) U$1.P$36
WHISKA_SW: U$1.P$44 U$22.2(G1)
Unconnected: ADC2.1(CH0) ADC2.2(CH1) IC1.5(PH0) IC1.6(PH1) IC1.8(PC0) IC1.10(PC2) IC1.11(PC3) IC1.24(PC4) IC1.33(PB12) IC1.34(PB13) IC1.35(PB14) IC1.41(PA8) IC1.44(PA11) IC1.45(PA12) IC1.50(JTDI) IC1.54(PD2) IC1.55(JTDO) IC1.56(JTRST) IC1.57(PB5) IC1.61(PB8) IC1.62(PB9) U$3.4(NC) U$4.INT1 U$4.INT2 U$15.P$8(8_PWRGD) U$17.P$8(8_PWRGD) U$22.3(S2) U$22.5(D02) U$22.6(D2) U$23.P$1(1_ON) U$23.P$2(2_OUT) U$23.P$3(3_GATEP) U$23.P$4(4_GND) U$23.P$8(8_PWRGD) U$27.P$1(1_ON) U$27.P$2(2_OUT) U$27.P$3(3_GATEP) U$27.P$4(4_GND)

## Notes on the sheet
- Overcurrent_protection_circuit
- SUN_SENSOR | GYRO_SENSOR
- +X_PANEL | -X_PANEL
- MAG_SENSOR
- FLASH_MEMORY | COMMON_CONNECTOR
- ADCS_PROCESSOR
- +Z_PANEL | -Y_PANEL
- +Z_connector
- solar_panel input
- CONTROL_IC FOR TOLUCA
- op amp power supply

## Power pins joined to a net without a drawn wire
G2: U$22.4(G2)

## Library data of the parts
ADC1-ADC4 = aoba01:ADC_MCP3208: MicroChip 12bit 8ch A/D converter
C1-C37 C43 C45-C62 = rcl:C-US: CAPACITOR, American symbol; SPICEPREFIX: C
C38-C42 C44 = resistor:C-US: CAPACITOR, American symbol
CR1 = SL23-E3:SL23-E3/52T; MANUFACTURER_PART_NUMBER: SL23E352T; VENDOR: Vishay
FLASH_CAM FLASH_SENSOR = aoba01:MP25P80: flashmemory
IC1 = stm32f446re:STM32F446_LQFP64: STM32F446_LQFP64 edit this description Auto generated by make-symbol-device-package-bsdl.ulp Rev. 44 Source: STM32F446_LQFP64.bsd
JP1 = pinhead:PINHD-1X5: PIN HEADER
L1 = SamacSys_Parts:LPS3015-222MRB: COILCRAFT - LPS3015-222MRB - INDUCTOR, SHLD, 2.2UH, 20%, 1.1A, SMD Source: Datasheet <https://componentsearchengine.com/Datasheets/1/LPS3015-222MRB.pdf>; DESCRIPTION: COILCRAFT - LPS3015-222MRB - INDUCTOR, SHLD, 2.2UH, 20%, 1.1A, SMD; HEIGHT: mm; MANUFACTURER_NAME: COILCRAFT; MANUFACTURER_PART_NUMBER: LPS3015-222MRB; MOUSER_PART_NUMBER: 994-LPS3015-222MRB; MOUSER_PRICE-STOCK: https://www.mouser.com/Search/Refine.aspx?Keyword=994-LPS3015-222MRB
Q1 Q3 = m-pad-2.1:BSS138: Fairchild Semiconductors BSS138 N-Channel Logic Level Enhancement Mode Field Effect Transistor General Description: These N-Channel enhancement mode field effect transistors are produced using Fairchild's proprietary, high cell density, DMOS technology. These products have been designed to minimize on-state resistance while provide rugged, reliable, and fast switching performance.These products are particularly suited for low voltage, low current applications such as small servo motor control, power MOSFET gate drivers, and other switching applications. Features: 0.22 A, 50 V. RDS(ON) = 3.5Ohm @ VGS = 10 V RDS(ON) = 6.0Ohm @ VGS = 4.5 V High density cell design for extremely low RDS(ON) Rugged and Reliable Compact industry standard SOT-23 surface mount package Please send any comments to: messi@users.sourceforge.net
R1-R58 R61-R64 R76-R78 R83-R90 R92 = rcl:R-US_: RESISTOR, American symbol; SPICEPREFIX: R
R59 R60 R65-R75 R79-R82 = resistor:R-US_: RESISTOR, American symbol
U1 = TPS63000:TPS63000DRCR; COMPTYPE: IC; MANUFACTURER: Texas Instruments; MOUNTTYPE: SMT; PACKAGEREFERENCE: DRC0010A; PARTNUMBER: TPS63000DRC; PIN_COUNT: 11; REFDES: RefDes; ROHS: Y; TYPE: TYPE
U2 = TPS63700:TPS63700DRCRG4; MANUFACTURER_PART_NUMBER: TPS63700DRCRG4; VENDOR: Texas Instruments
U$1 = 1.27_2_60_pinhead:1.27_60
U$3 = MMC5883MA-B:MMC5883MA-B
U$4 = L3GD20_set:L3GD20_SET
U$5-U$12 = NJM064M:NJM064M
U$13 = JST01:JST_3
U$14 = aoba:ADR3525
U$15 U$17 U$23 U$27 = aoba:LTC4361
U$16 U$19 U$22 = aoba:IRF7910
U$18 = aoba:LT6106
U$20 = Kill-Sw:TR-NPN-2SC3326
U$21 = JST_1mm_5:JST_1MM_10
U$26 = VLF4012:VLF4012
U$31 U$32 U$34 = JST_1mm_5:JST_1MM_5
V_REF1-V_REF3 = linear:LM50: SOT-23 Single-Supply Centigrade Temperature Sensor Vout = (10mV/°C x Temp °C) +5mmmV Source: http://cache.national.com/ds/LM/LM50.pdf
WHISKAPAD1 WHISKAPAD2 = awhiska:WHISKAPAD: whiska
X_DRV X_DRV1 X_DRV2 = DRV8832_DGQ_10:DRV8832_DGQ_10; DATASHEETURL: httpwww.ti.comlitgpnDRV8832; FAMILY_NAME: BRUSHED DC DRIVER; GENERIC_PART_NUMBER: DRV8832; INDUSTRY_STD_PKG_TYPE: MSOPPowerPAD; MANUFACTURER: Texas Instruments; MANUFACTURER_PART_NUMBER: drv8832_dgq_10; PACKAGE_DESIGNATOR: DGQ; PIN_COUNT: 10; VENDOR: Texas Instruments